# Altium schematic sheet Signal_RX.SchDoc: Signal_RX
size A4; DocumentNumber: 2; SheetNumber: 2; SheetTotal: 6
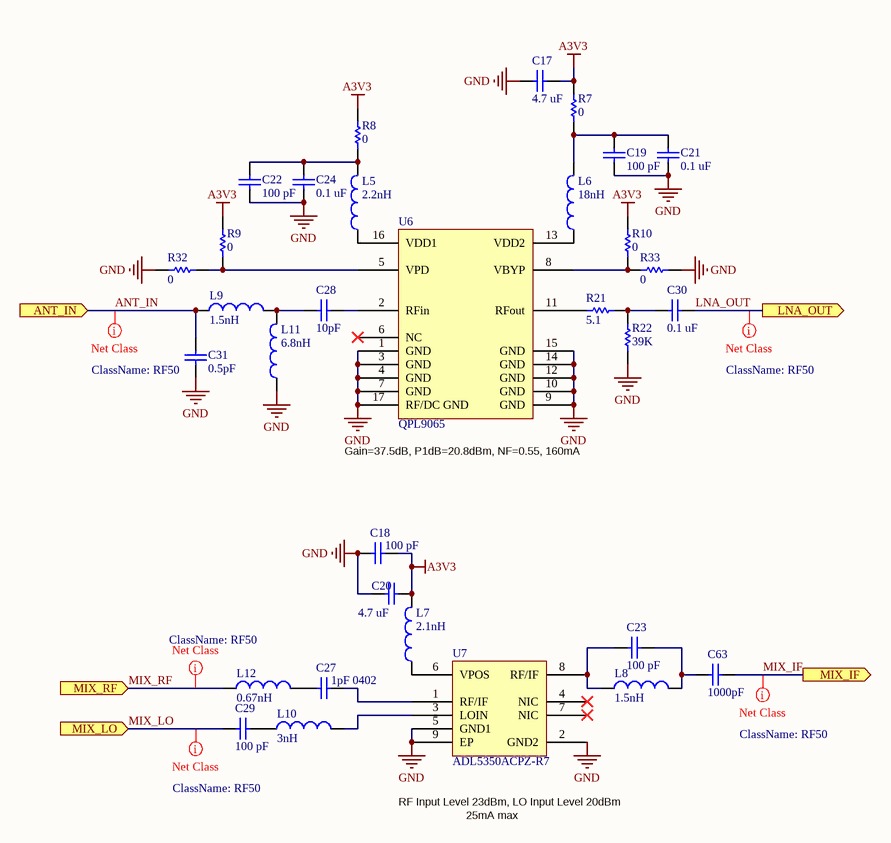
[diagram p0: Signal_RX.SchDoc]

## Parts
C17  4.7 uF  [CAPC1608X10L]
C18  100 pF  [CAPC1005X05L]
C19  100 pF  [CAPC1005X05L]
C20  4.7 uF  [CAPC1608X10L]
C21  0.1 uF  [CAPC1005X05L]
C22  100 pF  [CAPC1005X05L]
C23  100 pF  [CAPC1005X05L]
C24  0.1 uF  [CAPC1005X05L]
C27  1pF 0402  [CAPC1005X05L]
C28  10pF  [CAPC1005X05L]
C29  100 pF  [CAPC1005X05L]
C30  0.1 uF  [CAPC1005X05L]
C31  0.5pF  [CAPC1005X05L]
C63  1000pF  [CAPC1005X05L]
L5  2.2nH  [INDC1005X06L]
L6  18nH  [INDC1811X10L 0603CS]
L7  2.1nH  [INDC0905X05N-0302CS]
L8  1.5nH  [INDC1005X06L]
L9  1.5nH  [INDC1005X06L]
L10  3nH  [INDC1005X06L]
L11  6.8nH  [INDC1005X06L]
L12  0.67nH  [INDC0905X05N-0302CS]
R7  0  [RESC1005X04L]
R8  0  [RESC1005X04L]
R9  0  [RESC1005X04L]
R10  0  [RESC1005X04L]
R21  5.1  [RESC1005X04L]
R22  39K  [RESC1005X04L]
R32  0  [RESC1005X04L]
R33  0  [RESC1005X04L]
U6  QPL9065  [QFN50P350X350X86_HS-17N-qorvo]
U7  ADL5350ACPZ-R7  [SON50P200X80_HS-9N]

## Ports
ANT_IN (in), LNA_OUT (out), MIX_IF (out), MIX_LO (in), MIX_RF (in)

## Nets
A3V3: C17.2 C18.2 C20.1 L7.2 R7.2 R8.1 R9.2 R10.1
GND: C17.1 C18.1 C19.2 C20.2 C21.1 C22.2 C24.1 C31.1 L11.1 R22.1 R32.2 R33.1 U6.1(GND) U6.3(GND) U6.4(GND) U6.7(GND) U6.9(GND) U6.10(GND) U6.12(GND) U6.14(GND) U6.15(GND) U6.17(RF/DC_GND) U7.2(GND2) U7.5(GND1) U7.9(EP)
ANT_IN: C31.2 L9.1 ; port ANT_IN
LNA_OUT: C30.1 ; port LNA_OUT
MIX_IF: C63.2 ; port MIX_IF
MIX_LO: C29.1 ; port MIX_LO
MIX_RF: L12.1 ; port MIX_RF
NetC19_1: C19.1 C21.2 L6.2 R7.1
NetC22_1: C22.1 C24.2 L5.2 R8.2
NetC23_1: C23.1 L8.1 U7.8(RF/IF)
NetC23_2: C23.2 C63.1 L8.2
NetC27_1: C27.1 L12.2
NetC27_2: C27.2 U7.1(RF/IF)
NetC28_1: C28.1 L9.2 L11.2
NetC28_2: C28.2 U6.2(RFin)
NetC29_2: C29.2 L10.1
NetC30_2: C30.2 R21.2 R22.2
NetL5_1: L5.1 U6.16(VDD1)
NetL6_1: L6.1 U6.13(VDD2)
NetL7_1: L7.1 U7.6(VPOS)
NetL10_2: L10.2 U7.3(LOIN)
NetR9_1: R9.1 R32.1 U6.5(VPD)
NetR10_2: R10.2 R33.2 U6.8(VBYP)
NetR21_1: R21.1 U6.11(RFout)

Not connected (* = marked no-connect by the designer): U6 6(NC)*; U7 4(NIC)* 7(NIC)*

## Layout directives
net class RF50: ANT_IN, LNA_OUT, MIX_IF, MIX_LO, MIX_RF

## Notes on the sheet
- (near U6) Gain=37.5dB, P1dB=20.8dBm, NF=0.55, 160mA
- RF Input Level 23dBm, LO Input Level 20dBm
- 25mA max
- Title
- Size:
- A4
- Number:
- Revision:
- Date:
- Sheet
- of

## Library data of the parts
C17 = GRM188R61C475KAAJD_1: Multilayer Ceramic Capacitors MLCC - SMD/SMT 0603 4.7uF 16volts X5R + - 10%; Manufacturer: Murata Electronics; Type: General Purpose MLCC; Voltage Rating DC: 16 V; Product Status: New Product; Voltage - Rated: 16V; Supplier 1: Mouser; Manufacturer Part Number: GRM188R61C475KAAJD; RoHS: RoHS Compliant; Category: Multilayer Ceramic Capacitors MLCC - SMD/SMT; Stock 1: 10870; Pricing 1: 1=0.262, 10=0.110, 100=0.066, 1000=0.056, 4000=0.042, 8000=0.040, 24000=0.037, 48000=0.035, 100000=0.030 (EUR); Capacitance: 4.7 uF; Height: 0.8 mm; Length: 1.6 mm; Package/Case: 0603 (1608 metric); Packaging: Reel; Product: General Type MLCCs; Series: GRM; Termination Style: SMD/SMT; Tolerance: 10 %; Width: 0.8 mm; Brand: Murata Electronics; Case Code - in: 0603; Case Code - mm: 1608; Dielectric: X5R; Maximum Operating Temperature: + 85 C; Minimum Operating Temperature: - 55 C; RoHS - Mouser: Y; Minimum Order Quantity: 1; Reeling: True; ComponentLink1URL: http://www.mouser.com/ds/2/281/c02e-2905.pdf; ComponentLink1Description: http://www.mouser.com/ds/2/281/c02e-2905.pdf; Supplier 2: Digi-Key; Stock 2: 0; Pricing 2: 1=0.27, 10=0.224, 25=0.154, 50=0.1262, 100=0.112, 250=0.08404, 500=0.07424, 1000=0.06582 (EUR); Temperature Coefficient: X5R; Mounting Type: Surface Mount, MLCC; Operating Temperature: -55°C ~ 85°C; Applications: General Purpose; Ratings: -; Package / Case: 0603 (1608 Metric); Size / Dimension: 0.063" L x 0.031" W (1.60mm x 0.80mm); Height - Seated (Max): -; Thickness (Max): 0.037" (0.95mm); Lead Spacing: -; Features: -; Lead Style: -; ComponentLink2URL: http://www.murata.com/~/media/webrenewal/support/library/catalog/products/capacitor/mlcc/c02e.ashx; ComponentLink2Description: http://www.murata.com/~/media/webrenewal/support/library/catalog/products/capacitor/mlcc/c02e.ashx; Supplier Part Number 1: 81-GRM188R61C475KAJD; Supplier Part Number 2: 490-10481-1-ND
C18 C19 C22 C23 C29 = GRM1555C1H101GA01D: CAP CER 100PF 50V NP0 0402; Manufacturer: Murata Electronics North America; Tolerance: ±2%; Temperature Coefficient: C0G, NP0; Supplier 1: Digi-Key; Manufacturer Part Number: GRM1555C1H101GA01D; RoHS: RoHS Compliant; Category: Capacitors; Stock 1: 145962; Pricing 1: 1=0.09, 10=0.038, 50=0.0208, 100=0.0177, 250=0.01444, 500=0.01236, 1000=0.00963, 5000=0.00803 (EUR); Packaging: Cut Tape (CT); Capacitance: 100pF; Voltage - Rated: 50V; Mounting Type: Surface Mount, MLCC; Operating Temperature: -55°C ~ 125°C; Applications: General Purpose; Ratings: -; Package / Case: 0402 (1005 Metric); Size / Dimension: 0.039" L x 0.020" W (1.00mm x 0.50mm); Height - Seated (Max): -; Thickness (Max): 0.022" (0.55mm); Lead Spacing: -; Features: -; Lead Style: -; ComponentLink1URL: http://www.murata.com/~/media/webrenewal/support/library/catalog/products/capacitor/mlcc/c02e.ashx; ComponentLink1Description: http://www.murata.com/~/media/webrenewal/support/library/catalog/products/capacitor/mlcc/c02e.ashx; Supplier Part Number 1: 490-6188-1-ND
C20 = GRM188R61C475KAAJD: Multilayer Ceramic Capacitors MLCC - SMD/SMT 0603 4.7uF 16volts X5R + - 10%; Manufacturer: Murata Electronics; Type: General Purpose MLCC; Voltage Rating DC: 16 V; Product Status: New Product; Voltage - Rated: 16V; Supplier 1: Mouser; Manufacturer Part Number: GRM188R61C475KAAJD; RoHS: RoHS Compliant; Category: Multilayer Ceramic Capacitors MLCC - SMD/SMT; Stock 1: 10870; Pricing 1: 1=0.262, 10=0.110, 100=0.066, 1000=0.056, 4000=0.042, 8000=0.040, 24000=0.037, 48000=0.035, 100000=0.030 (EUR); Capacitance: 4.7 uF; Height: 0.8 mm; Length: 1.6 mm; Package/Case: 0603 (1608 metric); Packaging: Reel; Product: General Type MLCCs; Series: GRM; Termination Style: SMD/SMT; Tolerance: 10 %; Width: 0.8 mm; Brand: Murata Electronics; Case Code - in: 0603; Case Code - mm: 1608; Dielectric: X5R; Maximum Operating Temperature: + 85 C; Minimum Operating Temperature: - 55 C; RoHS - Mouser: Y; Minimum Order Quantity: 1; Reeling: True; ComponentLink1URL: http://www.mouser.com/ds/2/281/c02e-2905.pdf; ComponentLink1Description: http://www.mouser.com/ds/2/281/c02e-2905.pdf; Supplier 2: Digi-Key; Stock 2: 0; Pricing 2: 1=0.27, 10=0.224, 25=0.154, 50=0.1262, 100=0.112, 250=0.08404, 500=0.07424, 1000=0.06582 (EUR); Temperature Coefficient: X5R; Mounting Type: Surface Mount, MLCC; Operating Temperature: -55°C ~ 85°C; Applications: General Purpose; Ratings: -; Package / Case: 0603 (1608 Metric); Size / Dimension: 0.063" L x 0.031" W (1.60mm x 0.80mm); Height - Seated (Max): -; Thickness (Max): 0.037" (0.95mm); Lead Spacing: -; Features: -; Lead Style: -; ComponentLink2URL: http://www.murata.com/~/media/webrenewal/support/library/catalog/products/capacitor/mlcc/c02e.ashx; ComponentLink2Description: http://www.murata.com/~/media/webrenewal/support/library/catalog/products/capacitor/mlcc/c02e.ashx; Supplier Part Number 1: 81-GRM188R61C475KAJD; Supplier Part Number 2: 490-10481-1-ND
C21 C24 C30 = CL05B104KO5NNNC: CAP CER 0.1UF 16V 10% X7R 0402; Manufacturer: Samsung Electro-Mechanics America, Inc; Capacitance: 0.1µF; Supplier 1: Digi-Key; Supplier Part Number 1: 1276-1001-1-ND; Manufacturer Part Number: CL05B104KO5NNNC; RoHS: RoHS Compliant; Category: Capacitors; Stock 1: 4178896; Pricing 1: 1=0.09, 10=0.013, 25=0.0096, 100=0.0061, 500=0.00424, 1000=0.0033, 2500=0.00297, 5000=0.00275 (EUR); Packaging: Cut Tape (CT); Tolerance: ±10%; Voltage - Rated: 16V; Temperature Coefficient: X7R; Mounting Type: Surface Mount, MLCC; Operating Temperature: -55°C ~ 125°C; Applications: General Purpose; Ratings: -; Package / Case: 0402 (1005 Metric); Size / Dimension: 0.039" L x 0.020" W (1.00mm x 0.50mm); Height - Seated (Max): -; Thickness (Max): 0.022" (0.55mm); Lead Spacing: -; Features: -; Lead Style: -; ComponentLink1URL: http://www.samsungsem.com/servlet/FileDownload?type=spec&file=CL05B104KO5NNNC.pdf; ComponentLink1Description: http://www.samsungsem.com/servlet/FileDownload?type=spec&file=CL05B104KO5NNNC.pdf
C27 = GRM1555C1H1R0CA01D: CAP CER 1PF 50V C0G/NP0 0402
C28 = GRM1555C1H100JA01D: CAP CER 10PF 50V C0G/NP0 0402; Manufacturer: Murata Electronics North America; Tolerance: ±5%; Temperature Coefficient: C0G, NP0; Supplier 1: Digi-Key; Manufacturer Part Number: GRM1555C1H100JA01D; RoHS: RoHS Compliant; Category: Capacitors; Stock 1: 670265; Pricing 1: 1=0.18, 10=0.025, 100=0.0112, 500=0.008, 1000=0.00629, 2500=0.00572, 5000=0.00526 (EUR); Packaging: Cut Tape (CT); Part Status: Active; Voltage - Rated: 50V; Operating Temperature: -55°C ~ 125°C; Features: -; Ratings: -; Applications: General Purpose; Mounting Type: Surface Mount, MLCC; Package / Case: 0402 (1005 Metric); Size / Dimension: 0.039" L x 0.020" W (1.00mm x 0.50mm); Height - Seated (Max): -; Thickness (Max): 0.022" (0.55mm); Lead Spacing: -; Lead Style: -; ComponentLink1URL: http://www.murata.com/~/media/webrenewal/support/library/catalog/products/capacitor/mlcc/c02e.ashx?la=en-us; ComponentLink1Description: http://www.murata.com/~/media/webrenewal/support/library/catalog/products/capacitor/mlcc/c02e.ashx?la=en-us; Supplier Part Number 1: 490-5921-1-ND
C31 = GJM1555C1HR50BB01D: CAP CER 0.5PF 50V C0G/NP0 0402; Manufacturer: Murata Electronics North America; Tolerance: ±0.1pF; Temperature Coefficient: C0G, NP0; Supplier 1: Digi-Key; Manufacturer Part Number: GJM1555C1HR50BB01D; RoHS: RoHS Compliant; Category: Capacitors; Stock 1: 43253; Pricing 1: 1=0.14, 10=0.101, 100=0.0474, 500=0.03328, 1000=0.02756, 2500=0.02564, 5000=0.02346 (EUR); Packaging: Cut Tape (CT); Part Status: Active; Voltage - Rated: 50V; Operating Temperature: -55°C ~ 125°C; Features: High Q, Low Loss; Ratings: -; Applications: RF, Microwave, High Frequency; Mounting Type: Surface Mount, MLCC; Package / Case: 0402 (1005 Metric); Size / Dimension: 0.039" L x 0.020" W (1.00mm x 0.50mm); Height - Seated (Max): -; Thickness (Max): 0.022" (0.55mm); Lead Spacing: -; Lead Style: -; ComponentLink1URL: http://search.murata.co.jp/Ceramy/image/img/A01X/G101/ENG/GJM1555C1HR50BB01-01.pdf; ComponentLink1Description: http://search.murata.co.jp/Ceramy/image/img/A01X/G101/ENG/GJM1555C1HR50BB01-01.pdf; Supplier Part Number 1: 490-6077-1-ND
C63 = GRM1555C1H102JA01D: CAP CER 1000PF 50V C0G/NP0 0402; Manufacturer: Murata Electronics North America; Tolerance: ±5%; Temperature Coefficient: C0G, NP0; Supplier 1: Digi-Key; Manufacturer Part Number: GRM1555C1H102JA01D; RoHS: RoHS Compliant; Category: Capacitors; Stock 1: 29189; Pricing 1: 1=0.12, 10=0.054, 100=0.0242, 500=0.01726, 1000=0.01355, 2500=0.01232, 5000=0.01134 (EUR); Packaging: Cut Tape (CT); Part Status: Active; Voltage - Rated: 50V; Operating Temperature: -55°C ~ 125°C; Features: -; Ratings: -; Applications: General Purpose; Mounting Type: Surface Mount, MLCC; Package / Case: 0402 (1005 Metric); Size / Dimension: 0.039" L x 0.020" W (1.00mm x 0.50mm); Height - Seated (Max): -; Thickness (Max): 0.022" (0.55mm); Lead Spacing: -; Lead Style: -; ComponentLink1URL: http://www.murata.com/~/media/webrenewal/support/library/catalog/products/capacitor/mlcc/c02e.ashx; ComponentLink1Description: http://www.murata.com/~/media/webrenewal/support/library/catalog/products/capacitor/mlcc/c02e.ashx; Supplier Part Number 1: 490-3244-1-ND
L5 = LQW15AN2N2C10D: FIXED IND 2.2NH 1A 27 MOHM SMD; Manufacturer: Murata Electronics North America; Type: Wirewound; Material - Core: Non-Magnetic; Tolerance: ±0.2nH; Shielding: Unshielded; DC Resistance (DCR): 27 mOhm Max; Q @ Freq: 25 @ 250MHz; Supplier 1: Digi-Key; Manufacturer Part Number: LQW15AN2N2C10D; RoHS: RoHS Compliant; Category: Inductors, Coils, Chokes; Stock 1: 98779; Pricing 1: 1=0.17, 10=0.154, 100=0.103, 500=0.08586, 1000=0.07212, 2500=0.06182 (EUR); Packaging: Cut Tape (CT); Part Status: Active; Ratings: -; Operating Temperature: -55°C ~ 125°C; Mounting Type: Surface Mount; Package / Case: 0402 (1005 Metric); Supplier Device Package: 0402 (1005 Metric); Size / Dimension: 0.039" L x 0.020" W (1.00mm x 0.50mm); Height - Seated (Max): 0.024" (0.60mm); ComponentLink1URL: http://search.murata.co.jp/Ceramy/image/img/P02/JELF243A-0051.pdf; ComponentLink1Description: http://search.murata.co.jp/Ceramy/image/img/P02/JELF243A-0051.pdf; Supplier Part Number 1: 490-6794-1-ND
L6 = 0603CS-18NXJLU: COILCRAFT - 0603CS-18NXJLU - INDUCTOR, RF, 18NH, 5%, 3.1GHZ, SMD
L7 = 0302CS-2N1XJLU: COILCRAFT - 0302CS-2N1XJLU - INDUCTOR, RF, 2.1NH,5%,15.94GHZ, SMD; Inductancia: 2.1; Corriente DC Nominal: 830; Encapsulado del Inductor de Alta Frecuencia: 0302 [Métrica 0805]; Construcción del Inductor: Bobinado; Resistencia DC Máxima: 0.082; Frecuencia Autorresonante Mín.: 5.94; Empaquetado: Cinta Cortada; Sustancia Extremadamente Preocupante (SVHC): No SVHC (12-Jan-2017); Encapsulado del Inductor: 0302 [Métrica 0805; Supplier 1: Farnell; Manufacturer: COILCRAFT; Manufacturer Part Number: 0302CS-2N1XJLU; RoHS: Y-EX; Stock 1: 120; Pricing 1: 1=1,21, 200=0,825, 500=0,567, 1000=0,453, 2000=0,361 (EUR); Rango de Producto: Serie 0302; Tolerancia de Inductancia: ± 5%; ComponentLink1URL: http://www.farnell.com/datasheets/1681869.pdf; ComponentLink1Description: http://www.farnell.com/datasheets/1681869.pdf; Supplier Part Number 1: 2285589
L8 L9 = LQP15MN1N5B02D: FIXED IND 1.5NH 280MA 200 MOHM; Manufacturer: Murata Electronics North America; Type: Thin Film; Material - Core: Non-Magnetic; Tolerance: ±0.1nH; Shielding: Unshielded; DC Resistance (DCR): 200 mOhm Max; Q @ Freq: 13 @ 500MHz; Supplier 1: Digi-Key; Manufacturer Part Number: LQP15MN1N5B02D; RoHS: RoHS Compliant; Category: Inductors, Coils, Chokes; Stock 1: 20118; Pricing 1: 1=0.16, 10=0.144, 100=0.0956, 500=0.07964, 1000=0.06691, 2500=0.05735 (EUR); Packaging: Cut Tape (CT); Part Status: Active; Ratings: -; Operating Temperature: -40°C ~ 85°C; Mounting Type: Surface Mount; Package / Case: 0402 (1005 Metric); Supplier Device Package: 0402 (1005 Metric); Size / Dimension: 0.039" L x 0.020" W (1.00mm x 0.50mm); Height - Seated (Max): 0.018" (0.45mm); ComponentLink1URL: http://search.murata.co.jp/Ceramy/image/img/P02/JELF243C-0007.pdf; ComponentLink1Description: http://search.murata.co.jp/Ceramy/image/img/P02/JELF243C-0007.pdf; Supplier Part Number 1: 490-1126-1-ND
L10 = LQP15MN3N0B02D: FIXED IND 3NH 190MA 400 MOHM SMD; Manufacturer: Murata Electronics North America; Type: Thin Film; Material - Core: Non-Magnetic; Tolerance: ±0.1nH; Shielding: Unshielded; DC Resistance (DCR): 400 mOhm Max; Q @ Freq: 13 @ 500MHz; Supplier 1: Digi-Key; Manufacturer Part Number: LQP15MN3N0B02D; RoHS: RoHS Compliant; Category: Inductors, Coils, Chokes; Stock 1: 25713; Pricing 1: 1=0.16, 10=0.144, 100=0.0956, 500=0.07964, 1000=0.06691, 2500=0.05735 (EUR); Packaging: Cut Tape (CT); Part Status: Active; Ratings: -; Operating Temperature: -40°C ~ 85°C; Mounting Type: Surface Mount; Package / Case: 0402 (1005 Metric); Supplier Device Package: 0402 (1005 Metric); Size / Dimension: 0.039" L x 0.020" W (1.00mm x 0.50mm); Height - Seated (Max): 0.018" (0.45mm); ComponentLink1URL: http://search.murata.co.jp/Ceramy/image/img/P02/JELF243C-0007.pdf; ComponentLink1Description: http://search.murata.co.jp/Ceramy/image/img/P02/JELF243C-0007.pdf; Supplier Part Number 1: 490-6755-1-ND
L11 = LQG15HS6N8J02D: FIXED IND 6.8NH 600MA 240 MOHM; Manufacturer: Murata Electronics North America; Type: Multilayer; Tolerance: ±5%; Shielding: Unshielded; DC Resistance (DCR): 240 mOhm Max; Q @ Freq: 8 @ 100MHz; Supplier 1: Digi-Key; Manufacturer Part Number: LQG15HS6N8J02D; RoHS: RoHS Compliant; Category: Inductors, Coils, Chokes; Stock 1: 201419; Pricing 1: 1=0.08, 10=0.051, 100=0.0335, 500=0.02792, 1000=0.02345, 2500=0.0201 (EUR); Packaging: Cut Tape (CT); Part Status: Active; Material - Core: -; Ratings: -; Operating Temperature: -55°C ~ 125°C; Mounting Type: Surface Mount; Package / Case: 0402 (1005 Metric); Supplier Device Package: 0402 (1005 Metric); Size / Dimension: 0.039" L x 0.020" W (1.00mm x 0.50mm); Height - Seated (Max): 0.022" (0.55mm); ComponentLink1URL: http://search.murata.co.jp/Ceramy/image/img/P02/JELF243B-0010.pdf; ComponentLink1Description: http://search.murata.co.jp/Ceramy/image/img/P02/JELF243B-0010.pdf; Supplier Part Number 1: 490-2621-1-ND
L12 = 0302CS-N67XKLU: COILCRAFT - 0302CS-N67XKLU - INDUCTOR, RF, 0.67NH, 10%,26GHZ, SMD; Inductancia: 0.67; Corriente DC Nominal: 1.6; Encapsulado del Inductor de Alta Frecuencia: 0302 [Métrica 0805]; Construcción del Inductor: Bobinado; Resistencia DC Máxima: 0.021; Frecuencia Autorresonante Mín.: 26; Empaquetado: Cinta Cortada; Sustancia Extremadamente Preocupante (SVHC): No SVHC (12-Jan-2017); Encapsulado del Inductor: 0302 [Métrica 0805; Supplier 1: Farnell; Manufacturer: COILCRAFT; Manufacturer Part Number: 0302CS-N67XKLU; RoHS: Y-EX; Pricing 1: 1=1,21, 200=0,825, 500=0,567, 1000=0,453 (EUR); Rango de Producto: Serie 0302; Tolerancia de Inductancia: ± 10%; ComponentLink1URL: http://www.farnell.com/datasheets/1681869.pdf; ComponentLink1Description: http://www.farnell.com/datasheets/1681869.pdf; Supplier Part Number 1: 2285624
R7-R10 R32 R33 = RC1005J000CS: RES 0.0 OHM 1/16W JUMP 0402; Manufacturer: Samsung Electro-Mechanics America, Inc; Resistance (Ohms): 0.0; Tolerance: Jumper; Power (Watts): 0.063W, 1/16W; Supplier 1: Digi-Key; Supplier Part Number 1: 1276-3480-1-ND; Manufacturer Part Number: RC1005J000CS; RoHS: RoHS Compliant; Category: Resistors; Stock 1: 2874816; Pricing 1: 1=0.09, 10=0.01, 25=0.0072, 100=0.0039, 500=0.00238, 1000=0.00174, 2500=0.00151, 5000=0.00125 (EUR); Packaging: Cut Tape (CT); Composition: Thick Film; Features: -; Temperature Coefficient: -; Operating Temperature: -55°C ~ 155°C; Package / Case: 0402 (1005 Metric); Supplier Device Package: 0402 (1005 Metric); Size / Dimension: 0.039" L x 0.020" W (1.00mm x 0.50mm); Height: 0.016" (0.40mm); Number of Terminations: 2; ComponentLink1URL: http://www.samsungsem.com/servlet/FileDownload?filename=productcatalog/pdf/Chip_Resistor.pdf; ComponentLink1Description: http://www.samsungsem.com/servlet/FileDownload?filename=productcatalog/pdf/Chip_Resistor.pdf
R21 = RC1005F5R1CS: RES SMD 5.1 OHM 1% 1/16W 0402; Manufacturer: Samsung Electro-Mechanics America, Inc.; Power (Watts): 0.063W, 1/16W; Temperature Coefficient: ±300ppm/°C; Supplier 1: Digi-Key; Manufacturer Part Number: RC1005F5R1CS; RoHS: RoHS Compliant; Category: Resistors; Stock 1: 277565; Pricing 1: 1=0.08, 10=0.012, 100=0.0048, 1000=0.00217, 2500=0.00189, 5000=0.00156 (EUR); Packaging: Cut Tape (CT); Part Status: Active; Tolerance: ±1%; Composition: Thick Film; Features: Moisture Resistant; Operating Temperature: -55°C ~ 155°C; Package / Case: 0402 (1005 Metric); Supplier Device Package: 0402; Size / Dimension: 0.039" L x 0.020" W (1.00mm x 0.50mm); Height - Seated (Max): 0.016" (0.40mm); Failure Rate: -; ComponentLink1URL: http://www.samsungsem.com/kr/support/library/product-catalog/__icsFiles/afieldfile/2015/09/22/CHIP_RESISTOR_2015.pdf; ComponentLink1Description: http://www.samsungsem.com/kr/support/library/product-catalog/__icsFiles/afieldfile/2015/09/22/CHIP_RESISTOR_2015.pdf; Supplier Part Number 1: 1276-3876-1-ND
R22 = RC0402FR-0739KL: RES SMD 39K OHM 1% 1/16W 0402; Manufacturer: Yageo; Power (Watts): 0.063W, 1/16W; Temperature Coefficient: ±100ppm/°C; Supplier 1: Digi-Key; Manufacturer Part Number: RC0402FR-0739KL; RoHS: RoHS Compliant; Category: Resistors; Stock 1: 555127; Pricing 1: 1=0.08, 10=0.012, 100=0.0046, 1000=0.0021, 2500=0.00182, 5000=0.0015 (EUR); Packaging: Cut Tape (CT); Part Status: Active; Tolerance: ±1%; Composition: Thick Film; Features: Moisture Resistant; Operating Temperature: -55°C ~ 155°C; Package / Case: 0402 (1005 Metric); Supplier Device Package: 0402; Size / Dimension: 0.039" L x 0.020" W (1.00mm x 0.50mm); Height - Seated (Max): 0.016" (0.40mm); Failure Rate: -; ComponentLink1URL: http://www.yageo.com/documents/recent/PYu-RC_Group_51_RoHS_L_7.pdf; ComponentLink1Description: http://www.yageo.com/documents/recent/PYu-RC_Group_51_RoHS_L_7.pdf; Supplier Part Number 1: 311-39.0KLRCT-ND
U6 = QPL9065: Manufacturer Part Number: 772-QPL9065TR13; Manufacturer: COILCRAFT; Inductancia: 18; Corriente DC Nominal: 700; Encapsulado del Inductor de Alta Frecuencia: 0603 [Métrica 1608]; Construcción del Inductor: Bobinado; Resistencia DC Máxima: 0.17; Tolerancia de Inductancia: ± 5%; Frecuencia Autorresonante Mín.: 3.1; Empaquetado: Cinta Cortada; Sustancia Extremadamente Preocupante (SVHC): No SVHC (12-Jan-2017); Estándar de Certificación para Automoción: AEC-Q200; Supplier 1: Farnell; RoHS: Y-EX; Stock 1: 2020; Pricing 1: 1=0,784, 200=0,586, 500=0,437, 1000=0,298 (EUR); Rango de Producto: Serie 0603; Encapsulado del Inductor: 0603 [Métrica 1608]; ComponentLink1URL: http://www.farnell.com/datasheets/1681877.pdf; ComponentLink1Description: http://www.farnell.com/datasheets/1681877.pdf; Supplier Part Number 1: 2285991
U7 = ADL5350ACPZ-R7: IC MIXER 750MHZ-4GHZ 8LFCSP; Manufacturer: Analog Devices Inc.; RF Type: Cellular, CDMA, GSM; Frequency: 750MHz ~ 4GHz; Noise Figure: 6.5dB; Current - Supply: 16.5mA; Voltage - Supply: 2.7 V ~ 3.5 V; Supplier 1: Digi-Key; Manufacturer Part Number: ADL5350ACPZ-R7; RoHS: RoHS Compliant; Category: RF/IF and RFID; Stock 1: 1344; Pricing 1: 1=5.72, 10=5.142, 100=4.2127, 500=3.58624, 1000=3.02454 (EUR); Packaging: Cut Tape (CT); Part Status: Active; Gain: -; Secondary Attributes: -; Package / Case: 8-VFDFN Exposed Pad, CSP; Supplier Device Package: 8-LFCSP-VD (3x2); ComponentLink1URL: http://www.analog.com/media/en/technical-documentation/evaluation-documentation/ADL5350.pdf; ComponentLink1Description: http://www.analog.com/media/en/technical-documentation/evaluation-documentation/ADL5350.pdf; Supplier Part Number 1: ADL5350ACPZ-R7CT-ND